# EAGLE design schematicamitfix (EAGLE 8.6.0)
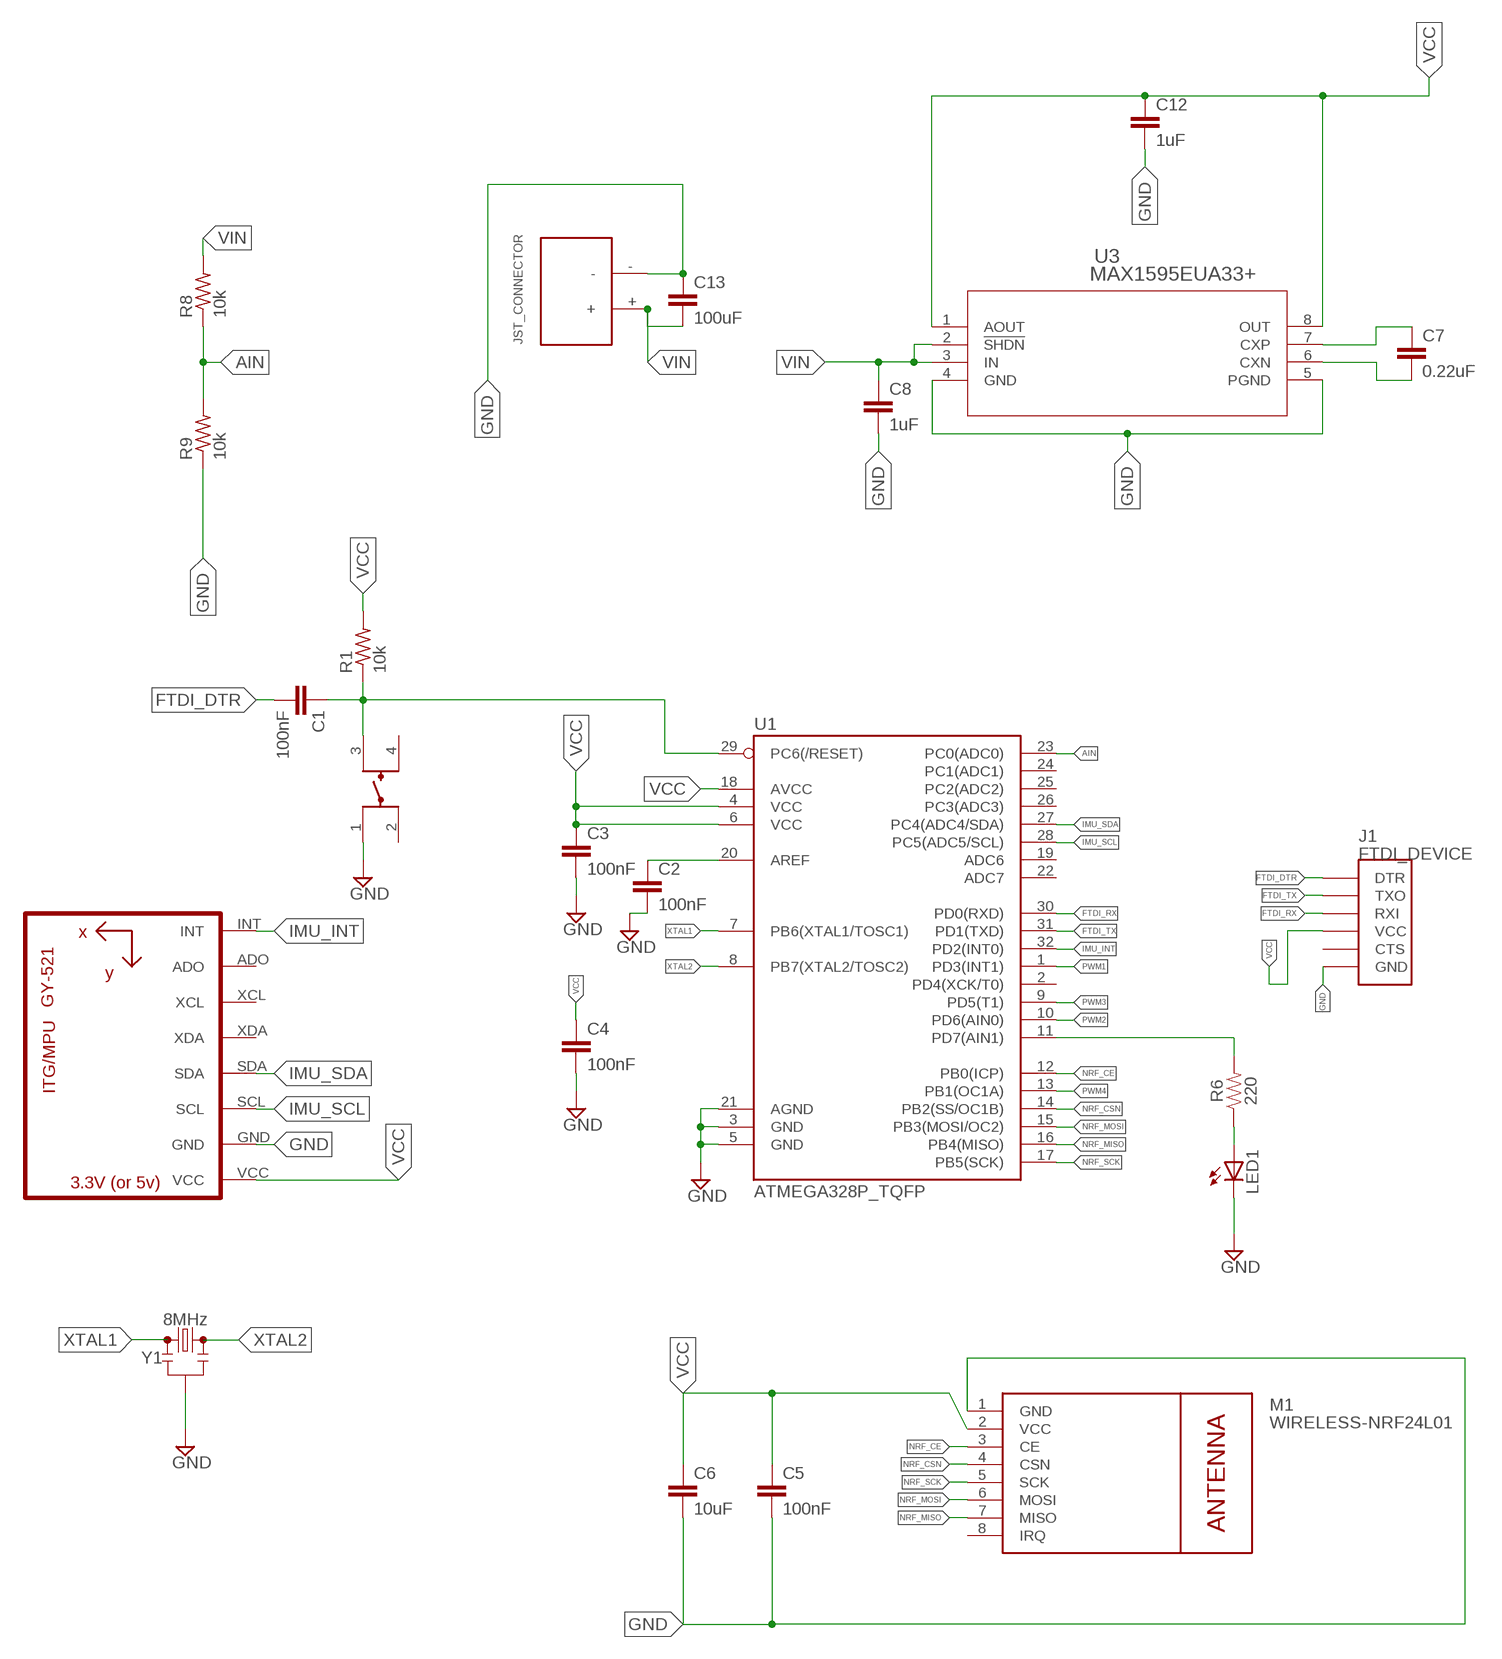
[diagram p0: schematic, sheet 1, part 1 of 3]
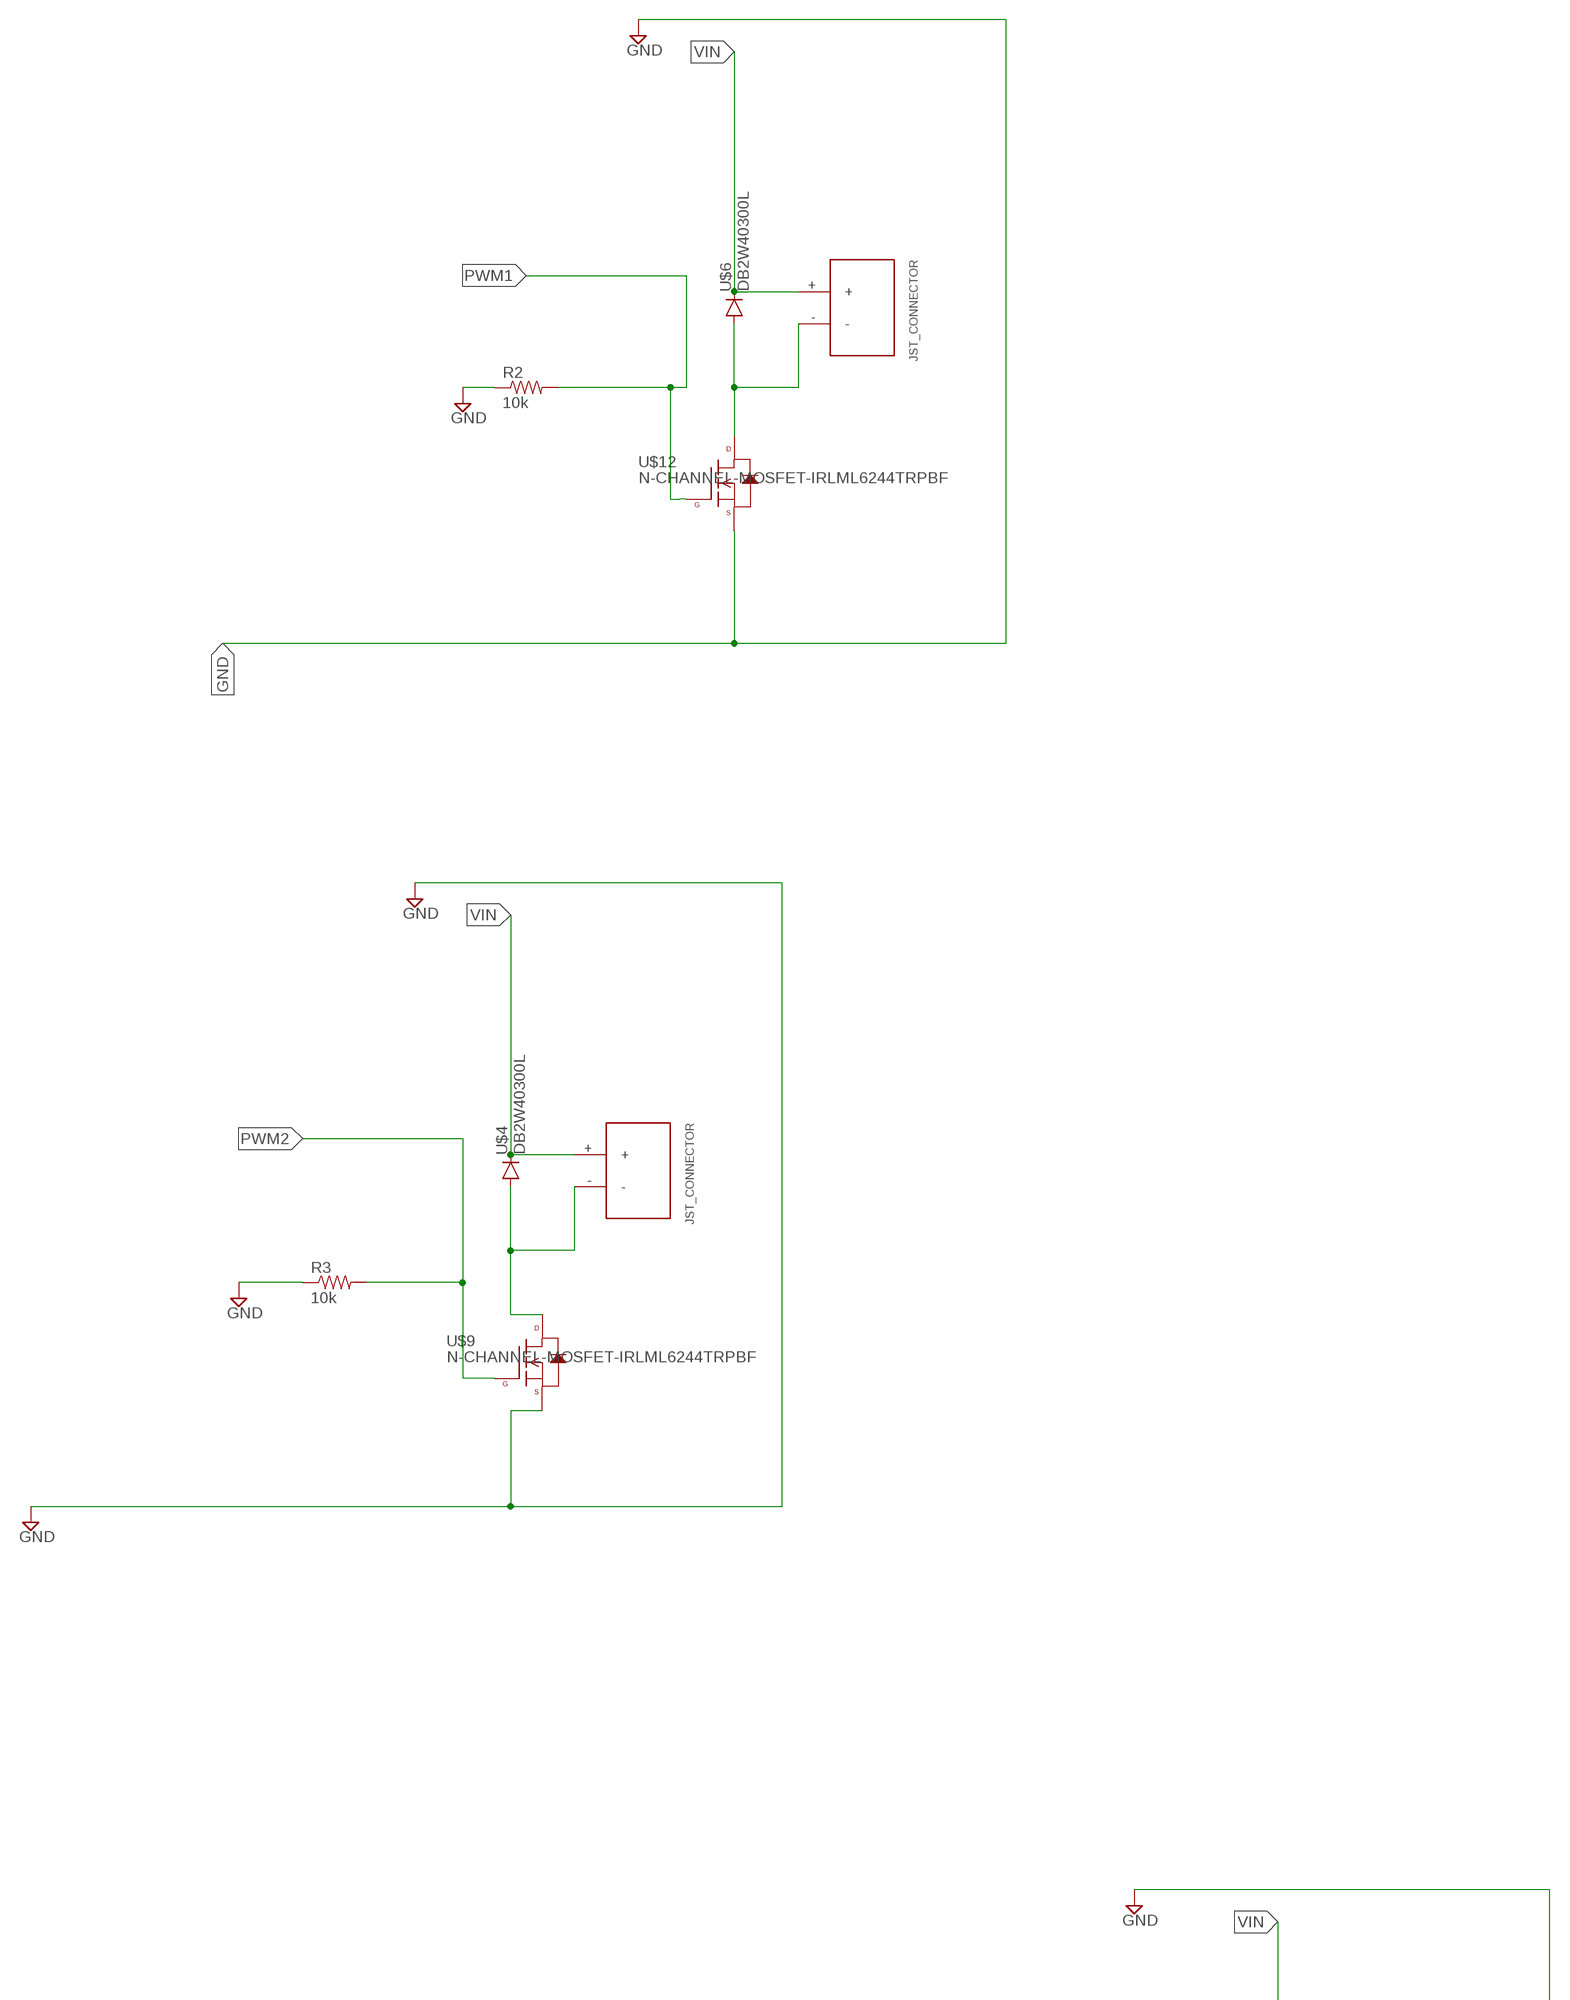
[diagram p1: schematic, sheet 1, part 2 of 3]
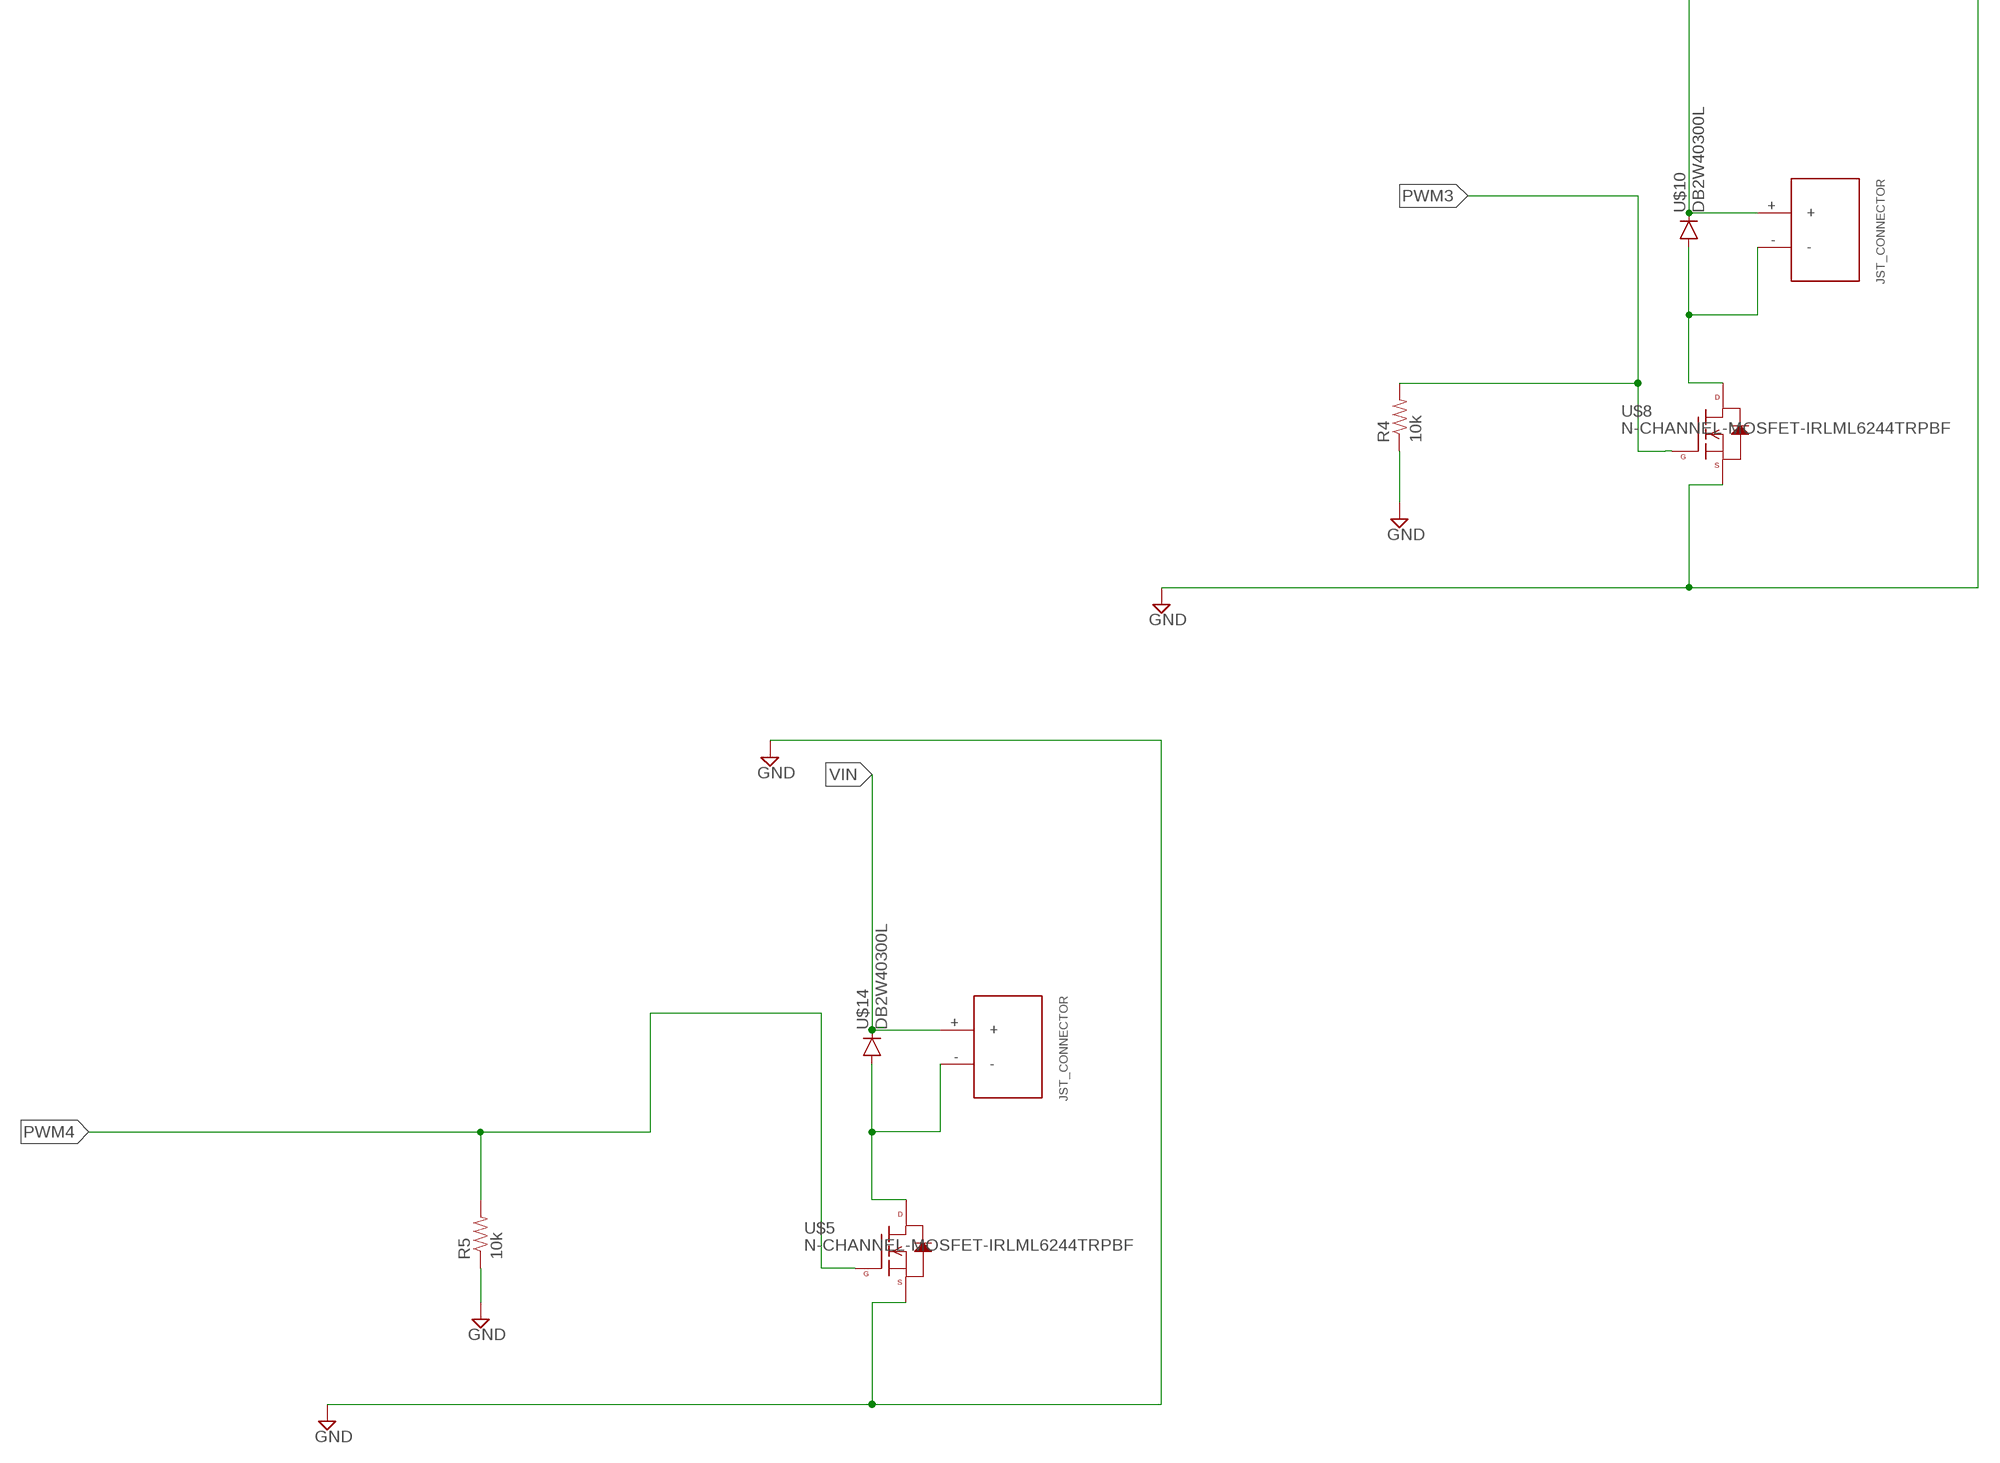
[diagram p2: schematic, sheet 1, part 3 of 3]

## Parts
C1  100nF  C-EUC0603  [C0603]
C2  100nF  C-EUC0603  [C0603]
C3  100nF  C-EUC0603  [C0603]
C4  100nF  C-EUC0603  [C0603]
C5  100nF  C-EUC0603  [C0603]
C6  10uF  C-EUC0603  [C0603]
C7  0.22uF  C-EUC0603  [C0603]
C8  1uF  C-EUC0805  [C0805]
C12  1uF  C-EUC0805  [C0805]
C13  100uF  C-EUC1210  [C1210]
J1  FTDI_DEVICE  [FTDI_DEVICE_SIDE]
LED1  LED1206  [LED-1206]
M1  WIRELESS-NRF24L01  [WIRELESS-NRF24L01]
R1  10k  R-US_R0603  [R0603]
R2  10k  RESISTOR0603  [0603-RES]
R3  10k  RESISTOR0603  [0603-RES]
R4  10k  RESISTOR0603  [0603-RES]
R5  10k  RESISTOR0603  [0603-RES]
R6  220  220OHM-0603-1/10W-1%  [0603]
R8  10k  R-US_R0603  [R0603]
R9  10k  R-US_R0603  [R0603]
U1  ATMEGA328P_TQFP  [TQFP32-08]
U2  GY-521MPU6050  [GY-521]
U3  MAX1595EUA33+  [21-0036K]
U$1  LL3301NF065QG  [LL3301NF065QG]
U$3  JST_CONNECTOR_FEMALE  [JST_CONNECTOR_FEMALE]
U$4  DB2W40300L  [MINI2-F3-B]
U$5  N-CHANNEL-MOSFET-IRLML6244TRPBF  [SOT23-3]
U$6  DB2W40300L  [MINI2-F3-B]
U$7  JST_CONNECTOR_FEMALE  [JST_CONNECTOR_FEMALE]
U$8  N-CHANNEL-MOSFET-IRLML6244TRPBF  [SOT23-3]
U$9  N-CHANNEL-MOSFET-IRLML6244TRPBF  [SOT23-3]
U$10  DB2W40300L  [MINI2-F3-B]
U$11  JST_CONNECTOR_FEMALE  [JST_CONNECTOR_FEMALE]
U$12  N-CHANNEL-MOSFET-IRLML6244TRPBF  [SOT23-3]
U$14  DB2W40300L  [MINI2-F3-B]
U$15  JST_CONNECTOR_FEMALE  [JST_CONNECTOR_FEMALE]
U$19  JST_CONNECTOR_FEMALE  [JST_CONNECTOR_FEMALE]
Y1  8MHz  RESONATOR-8MHZSMD_3.2X1.3  [RESONATOR-SMD-3.2X1.3]

## Nets
AIN: R8.1 R9.2 U1.23(PC0(ADC0))
FTDI_DTR: C1.2 J1.P$1(DTR)
FTDI_RX: J1.P$3(RXI) U1.30(PD0(RXD))
FTDI_TX: J1.P$2(TXO) U1.31(PD1(TXD))
GND: C2.2 C3.2 C4.2 C5.2 C6.2 C8.2 C12.2 C13.1 J1.P$6(GND) LED1.C M1.1(GND) R2.1 R3.1 R4.1 R5.1 R9.1 U1.3(GND) U1.5(GND) U1.21(AGND) U2.GND U3.4(GND) U3.5(PGND) U$1.1 U$5.2(S) U$8.2(S) U$9.2(S) U$12.2(S) U$19.- Y1.2
IMU_INT: U1.32(PD2(INT0)) U2.INT
IMU_SCL: U1.28(PC5(ADC5/SCL)) U2.SCL
IMU_SDA: U1.27(PC4(ADC4/SDA)) U2.SDA
N$1: C1.1 R1.1 U1.29(PC6(/RESET)) U$1.3
N$2: C2.1 U1.20(AREF)
N$5: U$3.- U$4.POS(PPIN) U$9.3(D)
N$6: C7.1 U3.7(CXP)
N$7: R6.2 U1.11(PD7(AIN1))
N$9: U$6.POS(PPIN) U$7.- U$12.3(D)
N$10: C7.2 U3.6(CXN)
N$11: LED1.A R6.1
N$13: U$8.3(D) U$10.POS(PPIN) U$11.-
N$17: U$5.3(D) U$14.POS(PPIN) U$15.-
NRF_CE: M1.3(CE) U1.12(PB0(ICP))
NRF_CSN: M1.4(CSN) U1.14(PB2(SS/OC1B))
NRF_MISO: M1.7(MISO) U1.16(PB4(MISO))
NRF_MOSI: M1.6(MOSI) U1.15(PB3(MOSI/OC2))
NRF_SCK: M1.5(SCK) U1.17(PB5(SCK))
PWM1: R2.2 U1.1(PD3(INT1)) U$12.1(G)
PWM2: R3.2 U1.10(PD6(AIN0)) U$9.1(G)
PWM3: R4.2 U1.9(PD5(T1)) U$8.1(G)
PWM4: R5.2 U1.13(PB1(OC1A)) U$5.1(G)
VCC: C3.1 C4.1 C5.1 C6.1 C12.1 J1.P$4(VCC) M1.2(VCC) R1.2 U1.4(VCC) U1.6(VCC) U1.18(AVCC) U2.VCC U3.1(AOUT) U3.8(OUT)
VIN: C8.1 C13.2 R8.2 U3.2(!SHDN) U3.3(IN) U$3.+ U$4.NEG(GPIN) U$6.NEG(GPIN) U$7.+ U$10.NEG(GPIN) U$11.+ U$14.NEG(GPIN) U$15.+ U$19.+
XTAL1: U1.7(PB6(XTAL1/TOSC1)) Y1.1
XTAL2: U1.8(PB7(XTAL2/TOSC2)) Y1.3
Unconnected: J1.P$5(CTS) M1.8(IRQ) U1.2(PD4(XCK/T0)) U1.19(ADC6) U1.22(ADC7) U1.24(PC1(ADC1)) U1.25(PC2(ADC2)) U1.26(PC3(ADC3)) U2.ADO U2.XCL U2.XDA U$1.2 U$1.4

## Library data of the parts
C1-C8 C12 C13 = rcl:C-EU: CAPACITOR, European symbol; SPICEPREFIX: C
J1 = quad:FTDI_DEVICE: Connector which mates to FTDI basic or FTDI cable.
LED1 = LilyPad-Wearables:LED: LEDs Standard schematic elements and footprints for 5mm, 3mm, 1206, and 0603 sized LEDs. 5mm - Spark Fun Electronics SKU : Comp-SBL
M1 = quad:WIRELESS-NRF24L01: 2.4 GHz Wireless Module based on NRF24L01 chip
R1 R8 R9 = rcl:R-US_: RESISTOR, American symbol; SPICEPREFIX: R
R2-R5 = SparkFun-Resistors:RESISTOR: Resistor Basic schematic elements and footprints for 0603, 1206, and PTH resistors.
R6 = SparkFun-Resistors:220OHM: 220Ω resistor A resistor is a passive two-terminal electrical component that implements electrical resistance as a circuit element. Resistors act to reduce current flow, and, at the same time, act to lower voltage levels within circuits. - Wikipedia; PROD_ID: RES-07861
U1 = quad:ATMEGA328P_TQFP; PROD_ID: IC-09069
U2 = quad:GY-521
U3 = MAX1595EUA33+:MAX1595EUA33+; MANUFACTURER_PART_NUMBER: MAX1595EUA33+; VENDOR: Maxim Integrated Products
U$1 = E-Switch:LL3301NF065QG
U$3 U$7 U$11 U$15 U$19 = quad:JST_CONNECTOR_FEMALE
U$4 U$6 U$10 U$14 = quad:DB2W40300L
U$5 U$8 U$9 U$12 = quad:N-CHANNEL-MOSFET: N-Channel MOSFET Mode Field Effect Transistor; DATASHEET: http://www.mouser.com/ds/2/196/irlml6244pbf-936666.pdf; MOUSER: 942-IRLML6244TRPBF; URL: http://www.mouser.com/Search/ProductDetail.aspx?R=IRLML6244TRPBFvirtualkey57370000virtualkey942-IRLML6244TRPBF
Y1 = SparkFun-Clocks:RESONATOR-8MHZ: 8MHz Resonator Digikey Example <http://www.digikey.com/product-detail/en/murata-electronics-north-america/CSTCE10M0G55-R0/490-1196-1-ND/584633> Frequency: 8MHz Frequency Stability: ±0.2% Frequency Tolerance: ±0.5% Capacitance: 33pF SparkFun Products Arduino Pro Mini 328- 3.3V/8MHz <https://www.sparkfun.com/products/11114> SparkFun Digital Sandbox <https://www.sparkfun.com/products/12651>; PROD_ID: XTAL-08895

## Board
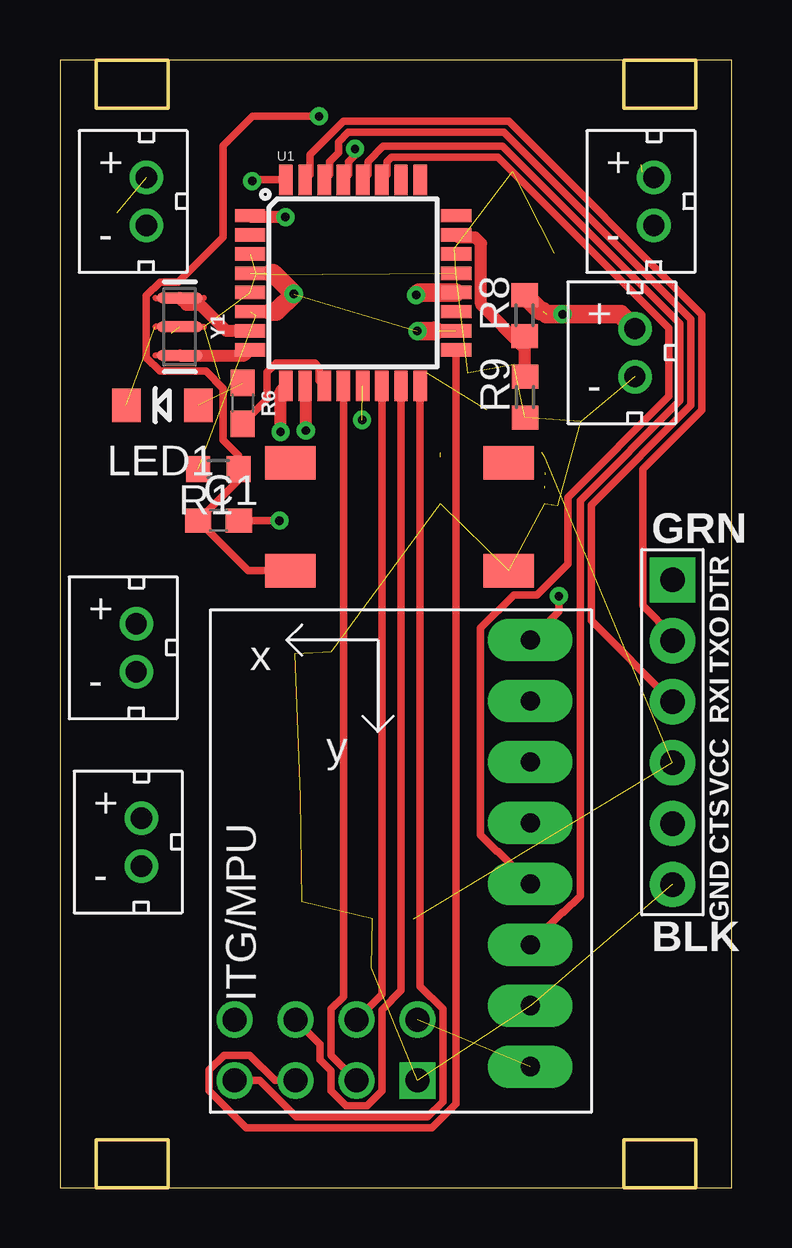
[diagram p3: board, top side]
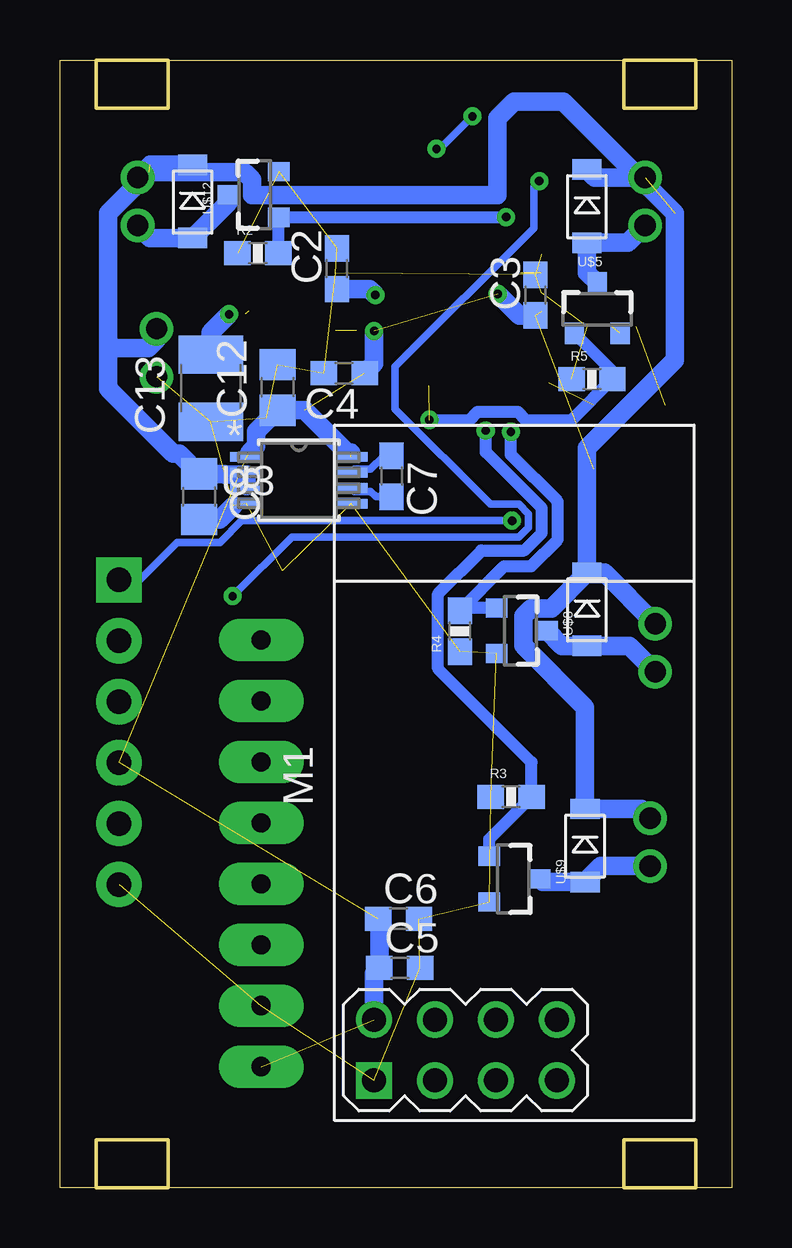
[diagram p4: board, bottom side, seen from below]

Size 28 x 47 mm. Coordinates in mm from the lower left corner, seen from the top.
Outline: 1.5,0 0,0 0,47 1.5,47
Outline: 4.5,0 23.5,0
Outline: 26.5,0 28,0 28,47 26.5,47
Outline: 23.5,47 4.5,47
Outline: 1.5,0 4.5,0
Outline: 4.5,0 4.5,2 1.5,2 1.5,0
Outline: 26.5,0 23.5,0
Outline: 23.5,0 23.5,2 26.5,2 26.5,0
Outline: 1.5,47 1.5,45 4.5,45 4.5,47
Outline: 4.5,47 1.5,47
Outline: 26.5,47 26.5,45 23.5,45 23.5,47
Outline: 23.5,47 26.5,47
Copper layers (1*16): Top 0.035mm / dielectric 1.5mm / Bottom 0.035mm
Design rules "default": minimum track width 6mil, minimum drill 0.35mm, track to track 6mil, track to pad 6mil, pad to pad 6mil, via to via 6mil, smd to smd 6mil, copper to edge 40mil, drill to drill 6mil, minimum pad ring 10mil, minimum via ring 8mil, stop-mask expansion 4mil, vias tented up to drill 0mil, thermal gap 10mil

### Footprints (pad centres in the part's own frame; a part is rotated, then mirrored left to right if it is on the bottom)
C0603 = smd 1.1 x 1: 1 -0.85,0; 2 0.85,0
C0805 = smd 1.3 x 1.5: 1 -0.95,0; 2 0.95,0
C1210 = smd 1.6 x 2.7: 1 -1.4,0; 2 1.4,0
FTDI_DEVICE_SIDE = drill 1.016 pad 1.88 square: P$1 -6.35,0 | drill 1.016 pad 1.88: P$2 -3.81,0; P$3 -1.27,0; P$4 1.27,0; P$5 3.81,0; P$6 6.35,0
LED-1206 = smd 1.2 x 1.4: A -1.5,0; C 1.5,0
WIRELESS-NRF24L01 = drill 1 square: 1 -12.7,6.35 | drill 1: 2 -10.16,6.35; 3 -12.7,3.81; 4 -10.16,3.81; 5 -12.7,1.27; 6 -10.16,1.27; 7 -12.7,-1.27; 8 -10.16,-1.27
R0603 = smd 1 x 1.1: 1 -0.85,0; 2 0.85,0
0603-RES = smd 1.1 x 1: 1 -0.85,0; 2 0.85,0
0603 = smd 1.1 x 1: 1 -0.85,0; 2 0.85,0
TQFP32-08 = smd 1.27 x 0.559: 1 -4.293,2.8; 2 -4.293,2; 3 -4.293,1.2; 4 -4.293,0.4; 5 -4.293,-0.4; 6 -4.293,-1.2; 7 -4.293,-2; 8 -4.293,-2.8; 17 4.293,-2.8; 18 4.293,-2; 19 4.293,-1.2; 20 4.293,-0.4; 21 4.293,0.4; 22 4.293,1.2; 23 4.293,2; 24 4.293,2.8 | smd 0.559 x 1.27: 9 -2.8,-4.293; 10 -2,-4.293; 11 -1.2,-4.293; 12 -0.4,-4.293; 13 0.4,-4.293; 14 1.2,-4.293; 15 2,-4.293; 16 2.8,-4.293; 25 2.8,4.293; 26 2,4.293; 27 1.2,4.293; 28 0.4,4.293; 29 -0.4,4.293; 30 -1.2,4.293; 31 -2,4.293; 32 -2.8,4.293
GY-521 = drill 0.8 pad 1.778 long: ADO -8.89,-6.35; GND -8.89,6.35; INT -8.89,-8.89; SCL -8.89,3.81; SDA -8.89,1.27; VCC -8.89,8.89; XCL -8.89,-3.81; XDA -8.89,-1.27
21-0036K = smd 1.372 x 0.406: 1 -2.184,0.975; 2 -2.184,0.325; 3 -2.184,-0.325; 4 -2.184,-0.975; 5 2.184,-0.975; 6 2.184,-0.325; 7 2.184,0.325; 8 2.184,0.975
LL3301NF065QG = smd 2.1 x 1.4: 1 0,0; 2 0,-4.5; 3 9.1,0; 4 9.1,-4.5
JST_CONNECTOR_FEMALE = drill 0.889: + 0,1; - 0,-1
MINI2-F3-B = smd 1.22 x 0.85: NEG 0,1.55; POS 0,-1.5
SOT23-3 = smd 0.8 x 0.9: 1 -0.95,-1; 2 0.95,-1; 3 0,1.1
RESONATOR-SMD-3.2X1.3 = smd 0.45 x 1.905: 1 -1.2,0; 2 0,0; 3 1.2,0

### Placement (x,y rotation side)
C1  6.61,27.8 0 top
C2  16.45,38.3 90 bottom
C3  8.17,37.2 90 bottom
C4  16.15,33.95 180 bottom
C5  13.83,9.15 0 bottom
C6  13.88,11.2 0 bottom
C7  14.18,29.65 270 bottom
C8  22.2,28.8 270 bottom
C12  18.93,33.35 90 bottom
C13  21.71,33.32 90 bottom
J1  25.54,18.98 270 top
LED1  4.27,32.61 180 top
M1  8.55,17.16 90 bottom
R1  6.6,29.95 180 top
R2  19.75,38.94 0 bottom
R3  9.19,16.29 0 bottom
R4  11.33,23.19 90 bottom
R5  5.82,33.69 0 bottom
R6  7.61,32.69 270 top
R8  19.37,36.35 90 top
R9  19.39,32.95 90 top
U1  12.22,37.71 0 top
U2  10.72,13.93 180 top
U3  18.04,29.48 0 bottom
U$1  18.71,25.71 180 top
U$3  3.39,14.4 0 top
U$4  6.11,14.23 0 bottom
U$5  5.6,36.61 0 bottom
U$6  22.47,41.08 0 bottom
U$7  24.76,41.1 0 top
U$8  8.8,23.21 270 bottom
U$9  9.1,12.86 270 bottom
U$10  6.03,24.08 0 bottom
U$11  3.18,22.5 0 top
U$12  19.87,41.39 90 bottom
U$14  6.03,40.88 0 bottom
U$15  3.6,41.1 0 top
U$19  23.97,34.8 0 top
Y1  4.99,35.88 270 top

### Tracks (layer width: path | path; a pad name or v marks a point on that pad's centre or on a via)
AIN
  Top 0.508: R8.1 19.37,35 | 19.37,35 19.37,33.82 R9.2 | 19.37,35 17.55,36.82 17.55,39.36 17.32,39.6 16.63,39.6 U1.23
FTDI_DTR  (via drill 0.35)
  Top 0.305: C1.2 v9.15,27.8
  Bottom 0.305: v9.15,27.8 20.42,27.8 21.32,26.89 23.11,26.89 24.67,25.33 J1.P$1
FTDI_RX
  Top 0.305: U1.30 11.24,42.22 11.24,42.76 11.62,43.15 11.62,43.58 12.02,43.98 18.52,43.98 26.31,36.19 26.31,32.61 22.15,28.45 22.15,23.64 J1.P$3
FTDI_TX
  Top 0.305: J1.P$2 25.54,23.02 24.3,24.26 24.3,29.95 26.77,32.42 26.77,36.38 18.71,44.44 11.83,44.44 10.44,43.05 10.44,42.22 U1.31
GND  (28 unrouted)
  Bottom 0.762: C8.2 21.34,27.85 20.77,28.42
IMU_INT  (via drill 0.35)
  Top 0.305: v8.02,41.95 8.07,42 U1.32 | U2.INT 20.8,24.01 v20.8,24.65
  Bottom 0.305: v8.02,41.95 8.24,41.72 8.24,39.99 14.03,34.21 14.03,32.46 10.05,28.48 8.87,28.48 8.47,28.08 8.47,27.52 8.87,27.12 18.33,27.12 v20.8,24.65
IMU_SCL
  Top 0.305: U2.SCL 20.96,11.47 20.99,11.47 21.69,12.17 21.69,28.64 25.85,32.8 25.85,36.01 18.46,43.4 13.47,43.4 12.84,42.76 12.84,42.22 U1.28
IMU_SDA
  Top 0.305: U2.SDA 18.26,14.01 18.23,14.01 17.53,14.71 17.53,23.31 18.92,24.7 19.89,24.7 21.17,25.99 21.17,28.76 25.39,32.98 25.39,35.82 18.27,42.94 13.81,42.94 13.64,42.76 13.64,42.22 U1.27
N$1  (via drill 0.35)
  Top 0.305: U$1.3 7.85,25.71 C1.1 7.45,29.49 R1.1 7.45,30.52 6.8,31.16 6.8,33.31 6.08,34.03 4.17,34.03 3.6,34.59 3.6,37.17 4.17,37.73 4.92,37.73 6.8,39.62 6.8,43.42 8.03,44.65 v10.8,44.65 | U1.29 12.04,42.22 12.04,42.76 12.3,43.03 v12.3,43.3
  Bottom 0.305: v10.8,44.65 12.15,43.3 v12.3,43.3
N$2  (via drill 0.35)
  Top 0.762: U1.20 14.96,37.31 v14.85,37.2
  Bottom 0.762: C2.1 15.1,37.45 v14.85,37.2
N$5
  Bottom 0.762: U$3.- 5.44,13.4 U$4.POS 7.87,12.73 U$9.3
N$6
  Bottom 0.305: U3.7 15.71,29.95 15.04,29.95 14.49,30.5 C7.1
N$7
  Top 0.305: R6.2 8.64,32.87 8.64,33.98 9.01,34.36 10.63,34.36 10.8,34.18 10.8,33.63 U1.11
N$9
  Bottom 0.762: U$7.- 24.24,39.58 U$6.POS 20.97,41.08 U$12.3
N$10
  Bottom 0.305: U3.6 15.71,29.01 15.04,29.01 14.83,28.8 C7.2
N$11  (1 unrouted)
N$13
  Bottom 0.762: U$11.- 4.26,22.58 U$10.POS 7.07,22.58 U$8.3
N$17
  Bottom 0.762: U$15.- 4.32,39.38 U$14.POS 6.03,38.14 U$5.3
NRF_CE
  Top 0.305: U1.12 11.82,7.96 11.3,7.44 11.3,5.52 M1.3
NRF_CSN
  Top 0.305: U1.14 13.42,8.06 M1.4
NRF_MISO
  Top 0.305: U1.16 15.02,8.38 15.96,7.44 15.96,3.58 15.32,2.94 9.84,2.94 8.32,4.46 M1.7
NRF_MOSI
  Top 0.305: U1.15 14.22,8.21 13.42,7.41 13.42,4.02 12.8,3.4 11.92,3.4 11.3,4.02 11.3,4.87 10.84,5.33 10.84,5.98 M1.6
NRF_SCK
  Top 0.305: U1.17 16.51,3.49 15.51,2.49 7.76,2.49 6.22,4.02 6.22,4.9 6.84,5.52 7.91,5.52 8.97,4.46 M1.5
PWM1  (via drill 0.35)
  Top 0.508: v9.4,40.45 7.99,40.45 U1.1
  Bottom 0.508: R2.2 18.9,40.41 U$12.1 v9.41,40.44 v9.4,40.45
PWM2  (via drill 0.35)
  Top 0.508: v10.25,31.55 10.25,33.39 U1.10
  Bottom 0.508: U$9.1 10.1,14.53 R3.2 8.34,17.73 12.24,21.62 12.24,24.76 10.44,26.56 8.64,26.56 7.91,27.29 7.91,28.31 10.25,30.66 v10.25,31.55
PWM3  (via drill 0.35)
  Top 0.508: v9.2,31.5 9.2,33.2 U1.9
  Bottom 0.508: U$8.1 11.21,24.16 R4.2 9.47,25.9 8.36,25.9 7.25,27.01 7.25,28.59 9.2,30.54 v9.2,31.5
PWM4  (via drill 0.35)  (1 unrouted)
  Bottom 0.508: U$5.1 4.97,34.03 R5.2 6.66,32 8.59,32 8.93,32.34 10.57,32.34 10.91,32 v12.6,32
VCC  (via drill 0.35)  (11 unrouted)
  Top 0.762: v14.9,35.7 15.63,35.7 15.64,35.71 | 8.8,38.11 8.89,38.11 v9.75,37.25 9.01,36.51 8.8,36.51
  Bottom 0.762: C4.1 14.9,34.35 v14.9,35.7 | 20.09,30.63 19.83,30.9 19.83,31.5 C12.1 17.8,32.4 16.03,30.63 15.86,30.63 | C3.1 8.85,36.35 v9.75,37.25 | M1.2 14.9,8.93 C5.1 14.68,11.15 C6.1
VIN  (via drill 0.35)  (5 unrouted)
  Top 0.762: 20.27,36.4 v20.95,36.4 23.39,36.4 23.39,36.38 U$19.+ 23.97,35.82 | 20.14,36.53 20.04,36.53 R8.2
  Bottom 0.762: U$14.NEG 5.7,42.1 U$15.+ | C13.2 21.71,35.64 v20.95,36.4 | U$6.NEG 24.23,42.63 U$7.+ | U$10.NEG 5.31,25.63 U$11.+ | 20.22,29.24 20.22,29.72 21.13,29.72 21.16,29.75 C8.1 23.04,30.59 23.28,30.59 25.99,33.3 25.99,35 | U$3.+ 3.77,15.78 U$4.NEG 6.11,20.02 8.68,22.59 8.68,23.83 8.37,24.14 7.52,24.14 U$10.NEG | U$10.NEG 6.03,30.83 2.37,34.49 2.37,40.61 7.02,45.26 9.08,45.26 9.77,44.57 9.77,41.37 19.99,41.37 19.99,42.01 20.3,42.32 24.28,42.32 25.99,40.61 25.99,35 | 25.99,35 24.32,35 23.97,35.35 U$19.+
XTAL1
  Top 0.508: Y1.1 5.28,36.79 5.85,36.79 6.93,35.71 U1.7
XTAL2
  Top 0.508: Y1.3 7.7,34.68 U1.8